# EasyEDA schematic SCH_airocat_2023-06-29.json
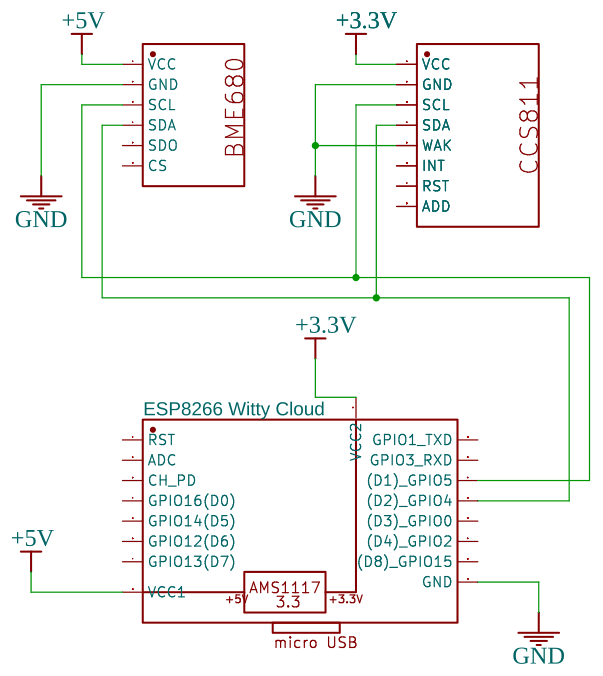
[diagram p0: schematic sheet]

## Parts
U1  BME680
U2  CCS811
U3  ESP8266 Witty Cloud

## Library data of the parts
U1 = BME680: Contributor: Guest
U2 = CCS811: Contributor: denysasauliak
U3 = ESP8266 Witty Cloud: Contributor: denysasauliak

## Nets
+3.3V: U2.1(VCC) U3.17(VCC2)
+5V: U1.1(VCC) U3.8(VCC1)
GND: U1.2(GND) U2.2(GND) U2.5(WAK) U3.9(GND)
Net-(U1-3): U1.3(SCL) U2.3(SCL) U3.14((D1) GPIO5)
Net-(U1-4): U1.4(SDA) U2.4(SDA) U3.13((D2) GPIO4)

Not connected (* = marked no-connect by the designer): U1 5(SDO) 6(CS); U2 6(INT) 7(RST) 8(ADD); U3 1(RST) 2(ADC) 3(CH_PD) 4(GPIO16(D0)) 5(GPIO14(D5)) 6(GPIO12(D6)) 7(GPIO13(D7)) 10((D8) GPIO15) 11((D4) GPIO2) 12((D3) GPIO0) 15(GPIO3 RXD) 16(GPIO1 TXD)
